# EasyEDA Pro project wireless charger receiver.eprj, board PCB2
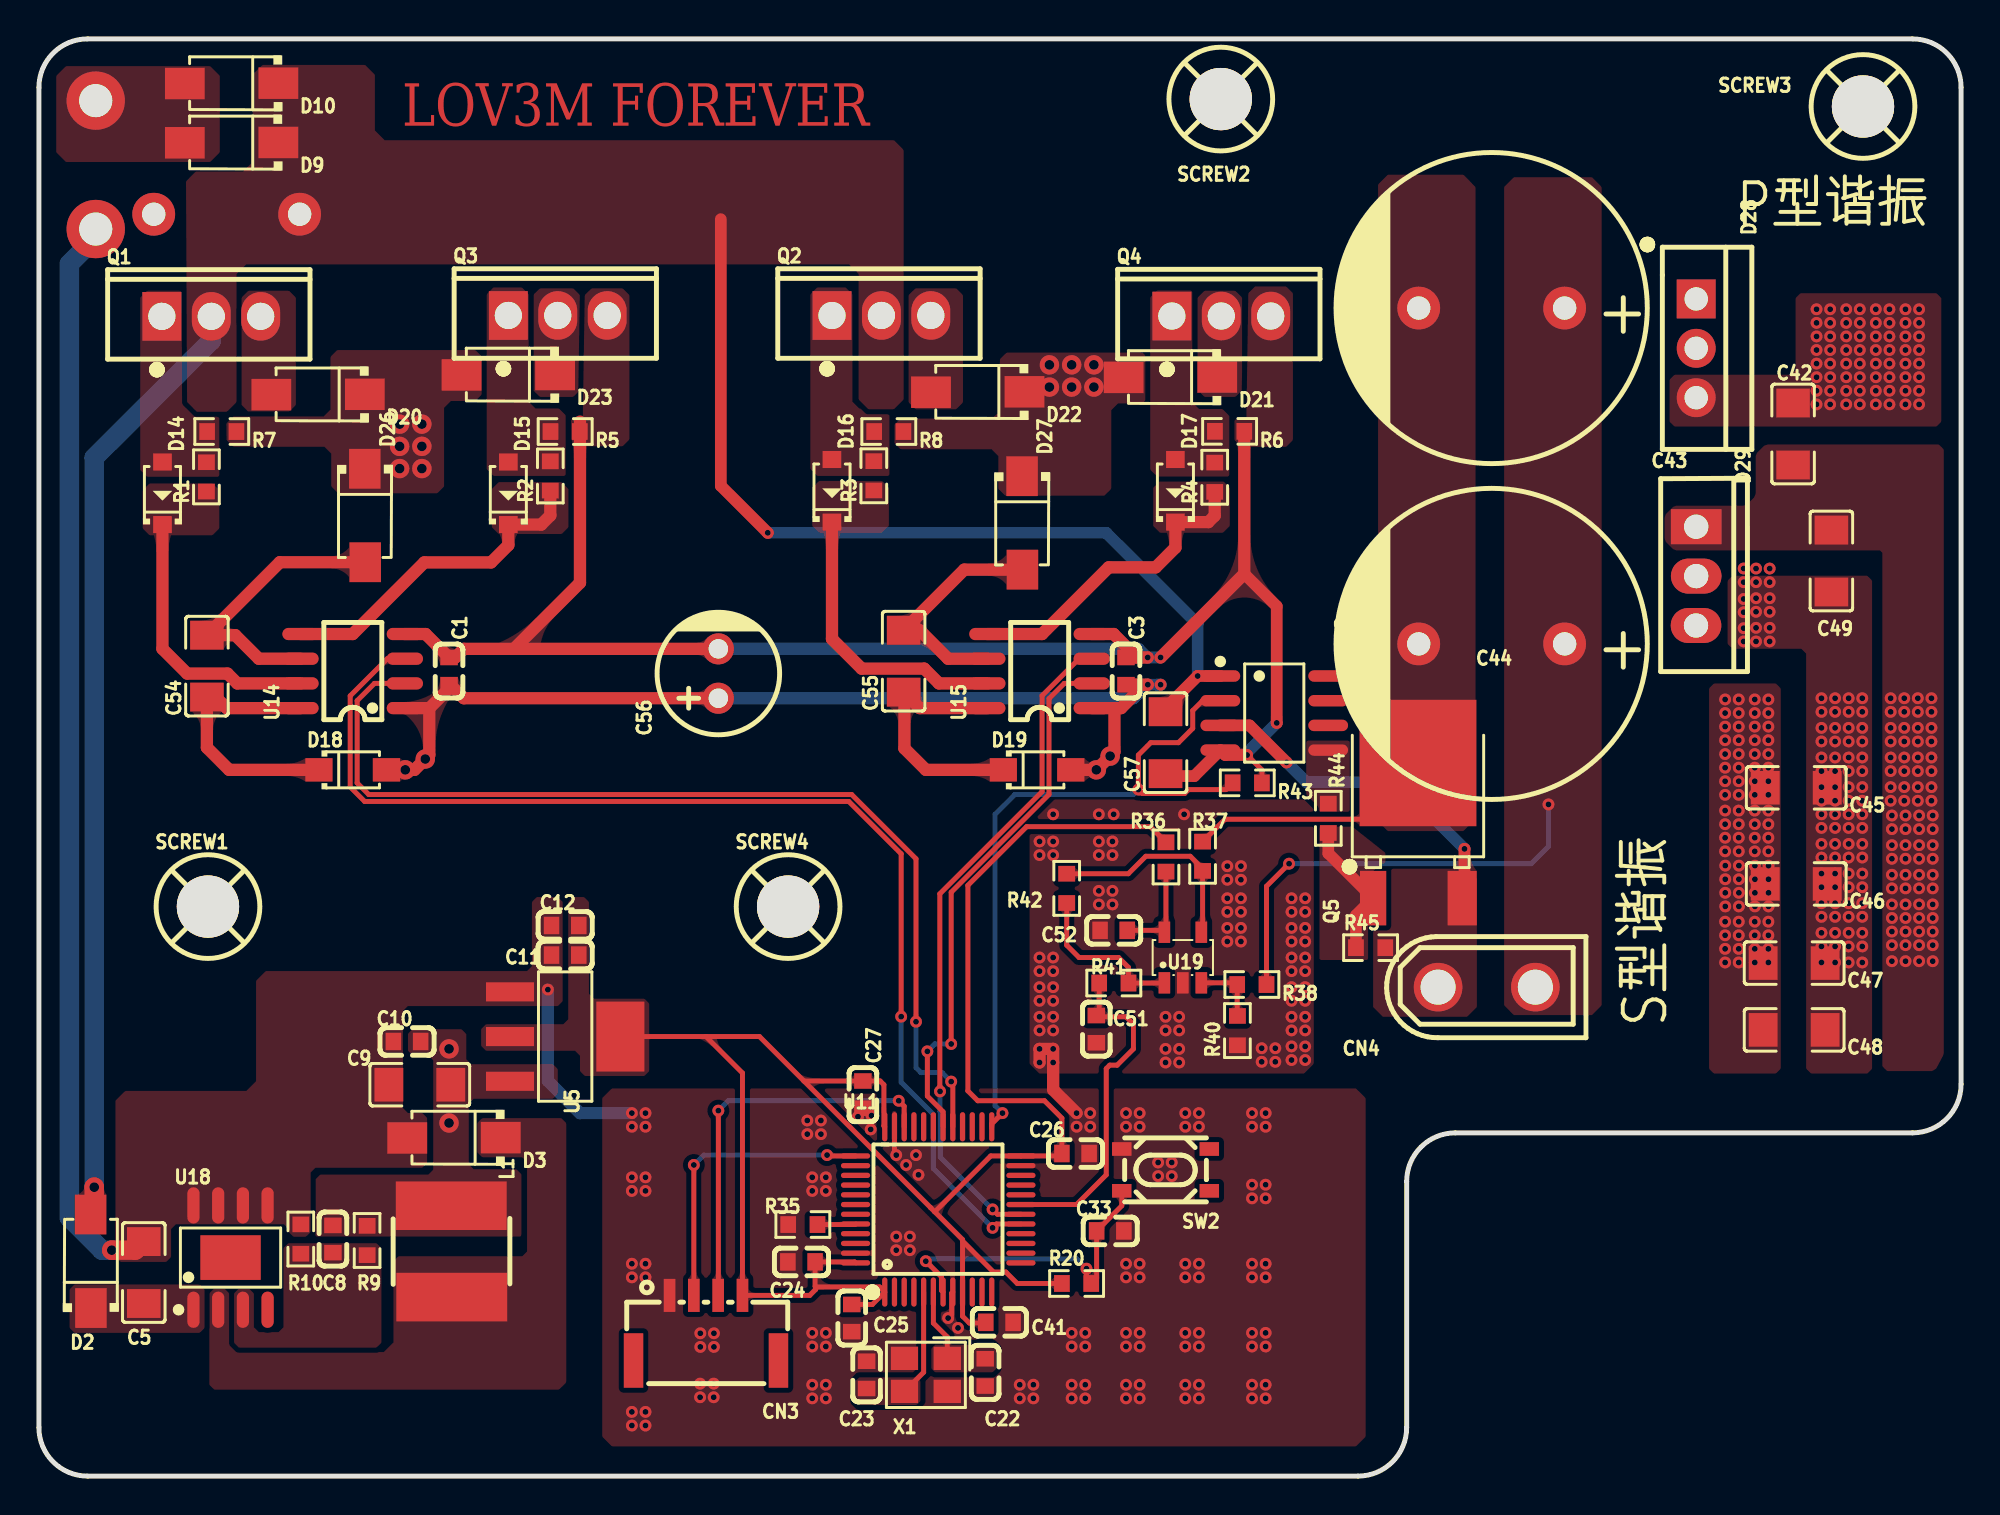
[diagram p3: board, top side]
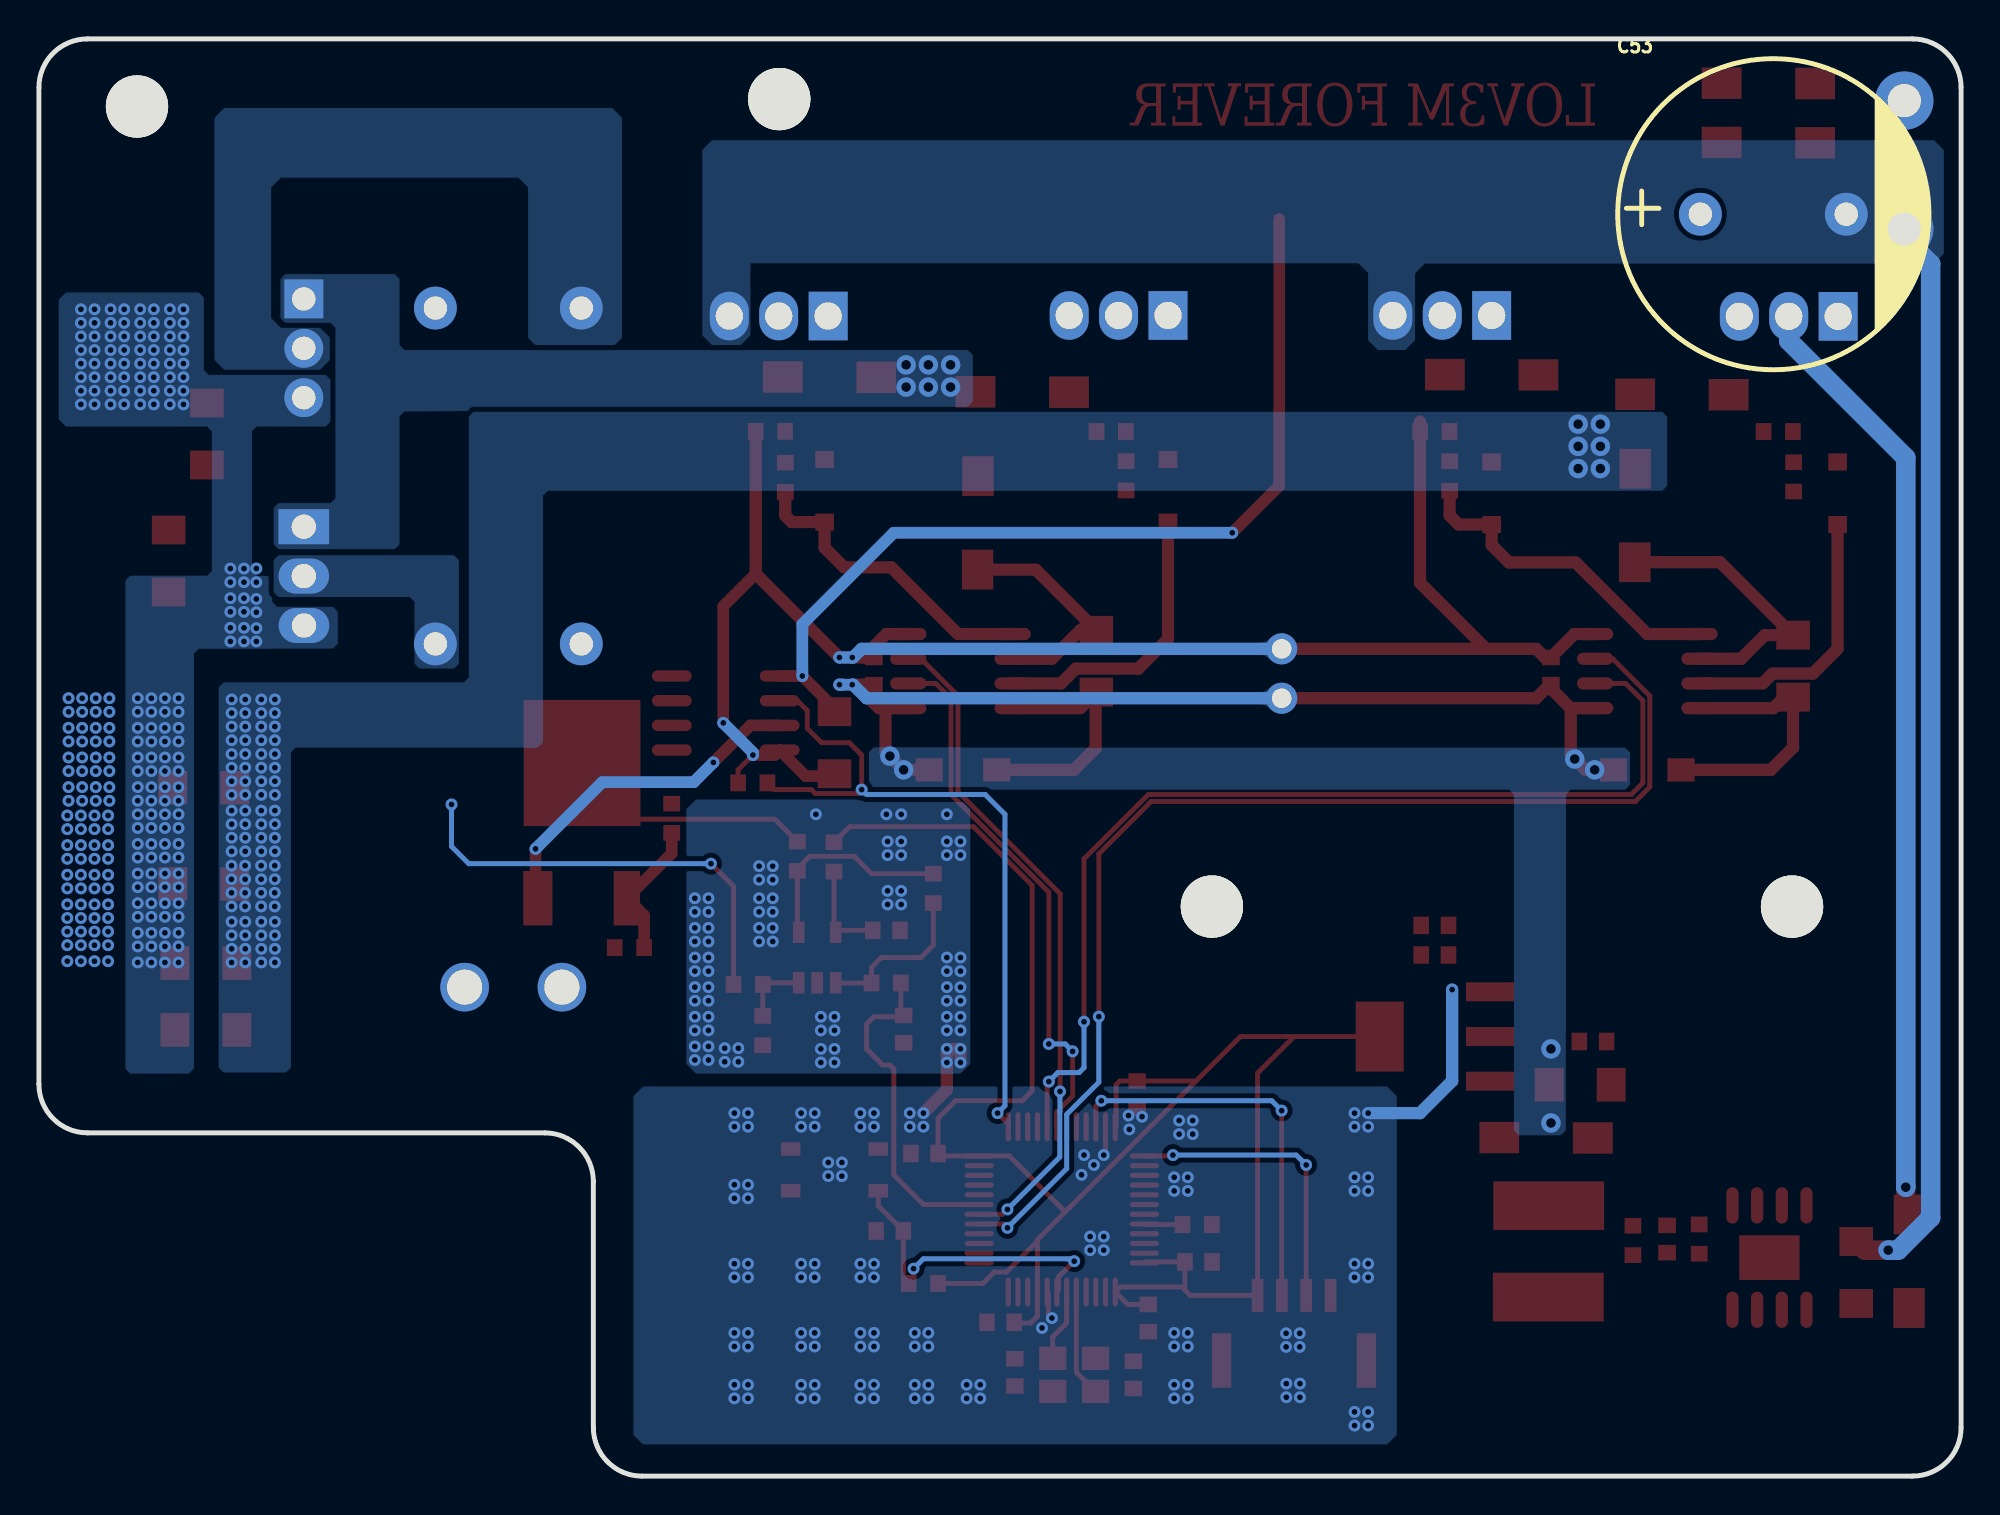
[diagram p4: board, bottom side, seen from below]

Outline 98.81 x 73.91 mm; copper layers: Top Layer, Bottom Layer. Coordinates in mm from the lower left corner of the outline.
Outline path: 0,71.41 0,2.5 arc(0.73,0.73) 2.5,0 67.81,0 arc(69.57,0.73) 70.31,2.5 70.31,15.15 arc(71.04,16.92) 72.81,17.65 96.31,17.65 arc(98.07,18.39) 98.81,20.15 98.81,71.41 arc(98.07,73.18) 96.31,73.91 2.5,73.91 arc(0.73,73.18) 0,71.41
Stack: Top Layer 0.035mm / Dielectric1 1.51mm FR4 er 4.5 / Bottom Layer 0.035mm

## Design rules (mm)
template: 自定义配置
spacing copperThickness1oz (default): track to track 0.102, other pairs 0.152 to 0.3
spacing copperThickness2oz: track to track 0.203, other pairs 0.152 to 0.3
track width copperThickness1oz (default): min 0.127, default 0.254, max 2.54
track width copperThickness2oz: min 0.203, default 0.254, max 2.54
differential pair differentialPair (default): width min 0.127, default 0.254, max 2.54; gap min 0.152, default 0.152
via viaSize (default): diameter min 0.5, default 0.61, max 10; hole min 0.3, default 0.305, max 6.3

## Placement (name value [footprint] x y rotation side)
C1  100nF  [C0603]  21.08 41.4 270 top
C3  100nF  [C0603]  55.88 41.4 270 top
C5  10uF  [C1206]  5.39 10.47 90 top
C8  33nF  [C0603]  15.11 12.19 90 top
C9  47uF  [C1206]  19.58 20.13 0 top
C10  100nF  [C0603]  18.92 22.35 0 top
C11  10uF  [C0603]  27.05 28.32 180 top
C12  100nF  [C0603]  27.05 26.8 0 top
C22  22pF  [C0603]  48.64 5.33 270 top
C23  22pF  [C0603]  42.55 5.21 270 top
C24  100nF  [C0603]  39.2 11.02 180 top
C25  100nF  [C0603]  41.78 8.13 270 top
C26  100nF  [C0603]  53.28 16.59 0 top
C27  100nF  [C0603]  42.36 19.62 270 top
C33  100nF  [C0603]  55.07 12.61 180 top
C41  100nF  [C0603]  49.37 7.91 180 top
C42  100nF  [C1206]  90.17 53.59 90 top
C43  470uF  [CAP-TH_BD16.0-P7.50-D1.2-FD]  74.68 60.07 180 top
C44  470uF  [CAP-TH_BD16.0-P7.50-D1.2-FD]  74.68 42.8 180 top
C45  ？nF  [C1206]  90.33 35.4 180 top
C46  ？nF  [C1206]  90.33 30.45 180 top
C47  ？nF  [C1206]  90.22 26.38 180 top
C48  ？nF  [C1206]  90.22 22.95 180 top
C49  ？nF  [C1206]  92.14 47.06 90 top
C51  10nF  [C0603]  54.36 22.99 270 top
C52  10nF  [C0603]  55.25 28.07 0 top
C53  470uF  [CAP-TH_BD16.0-P7.50-D1.2-FD]  9.65 64.9 180 bottom
C54  1uF  [C1206]  8.64 41.66 90 top
C55  1uF  [C1206]  44.45 41.91 90 top
C56  100uF  [CAP-TH_BD6.3-P2.50-D1.0-FD]  34.93 41.28 90 top
C57  10uF  [C1206]  57.91 37.72 90 top
CN3  ZX-BX-GH1.25-LT4  [CONN-SMD_ZX-BX-GH1.25-LT4]  34.29 7.62 0 top
CN4  XT30UPB-M  [CONN-TH_XT30UPB-M]  74.42 25.15 0 top
D2  SS510  [SMA_L4.3-W2.6-LS5.0-RD]  2.67 11.05 90 top
D3  SS510  [SMA_L4.3-W2.6-LS5.0-RD]  21.34 17.4 180 top
D9  SS520  [SMA_L4.3-W2.6-LS5.0-RD]  9.91 68.58 180 top
D10  SS520  [SMA_L4.3-W2.6-LS5.0-RD]  9.91 71.63 180 top
D14  1N4148W  [SOD-123_L2.7-W1.6-LS3.7-FD]  6.35 50.55 270 top
D15  1N4148W  [SOD-123_L2.7-W1.6-LS3.7-FD]  24.13 50.55 270 top
D16  1N4148W  [SOD-123_L2.7-W1.6-LS3.7-FD]  40.77 50.67 270 top
D17  1N4148W  [SOD-123_L2.7-W1.6-LS3.7-FD]  58.42 50.67 270 top
D18  FR107W  [SOD-123FL_L2.7-W1.8-LS3.8-RD]  16.13 36.32 0 top
D19  FR107W  [SOD-123FL_L2.7-W1.8-LS3.8-RD]  51.31 36.32 0 top
D20  SS520  [SMA_L4.3-W2.6-LS5.0-RD]  14.35 55.63 180 top
D21  SS520  [SMA_L4.3-W2.6-LS5.0-RD]  58.17 56.52 180 top
D22  SS520  [SMA_L4.3-W2.6-LS5.0-RD]  48.26 55.75 180 top
D23  SS520  [SMA_L4.3-W2.6-LS5.0-RD]  24.13 56.64 180 top
D26  SS520  [SMA_L4.3-W2.6-LS5.0-RD]  16.76 49.4 270 top
D27  SS520  [SMA_L4.3-W2.6-LS5.0-RD]  50.55 49.02 270 top
D28  MURF2060CTR  [TO-220F-3_L10.2-W4.7-P2.54-L]  85.19 58 270 top
D29  MURF2060CT  [TO-220-3_L9.9-W4.5-P2.54-L-1]  85.19 46.29 270 top
L1  100uH  [IND-SMD_L6.0-W6.0_FNR60XXS]  21.21 11.56 270 top
NOREF  -  [Pad_e615]  2.92 64.14 0 top
NOREF#2  -  [Pad_e617]  2.92 70.74 0 top
Q1  STP110N10F7-VB  [TO-220AB-3_L10.4-W4.6-P2.54-L]  8.86 59.64 0 top
Q2  STP110N10F7-VB  [TO-220AB-3_L10.4-W4.6-P2.54-L]  43.31 59.69 0 top
Q3  STP110N10F7-VB  [TO-220AB-3_L10.4-W4.6-P2.54-L]  26.67 59.69 0 top
Q4  STP110N10F7-VB  [TO-220AB-3_L10.4-W4.6-P2.54-L]  60.78 59.66 0 top
Q5  NCEP0178AK  [TO-252-2_L6.5-W6.1-P4.58-LS10.0-TL]  70.87 33.2 90 top
R1  4.7Ω  [R0603]  8.61 51.39 90 top
R2  4.7Ω  [R0603]  26.29 51.44 90 top
R3  4.7Ω  [R0603]  42.92 51.44 90 top
R4  4.7Ω  [R0603]  60.44 51.37 90 top
R5  10kΩ  [R0603]  27.05 53.72 180 top
R6  10kΩ  [R0603]  61.21 53.73 180 top
R7  10kΩ  [R0603]  9.4 53.72 180 top
R8  10kΩ  [R0603]  43.69 53.72 180 top
R9  30kΩ  [R0603]  16.87 12.12 90 top
R10  3.4kΩ  [R0603]  13.46 12.19 270 top
R20  10kΩ  [R0603]  53.34 9.91 180 top
R35  10kΩ  [R0603]  39.27 12.94 180 top
R36  100Ω  [R0603]  57.93 31.84 90 top
R37  40kΩ  [R0603]  59.82 31.88 270 top
R38  40kΩ  [R0603]  62.35 25.28 180 top
R40  1kΩ  [R0603]  61.61 22.91 90 top
R41  1kΩ  [R0603]  55.25 25.36 0 top
R42  1kΩ  [R0603]  52.83 30.23 90 top
R43  10kΩ  [R0603]  62.11 35.65 180 top
R44  4.7Ω  [R0603]  66.28 33.83 270 top
R45  10kΩ  [R0603]  68.45 27.18 0 top
SCREW1  -  [M3螺丝]  8.69 29.29 0 top
SCREW2  -  [M3螺丝]  60.75 70.82 0 top
SCREW3  -  [M3螺丝]  93.76 70.44 0 top
SCREW4  -  [M3螺丝]  38.51 29.29 0 top
SW2  TS3425BA  [SW-SMD_4P-L4.2-W3.2-P2.15-LS4.6-1]  57.91 15.75 180 top
U5  SPX1117M3-L-3-3/TR  [SOT-223-4_L6.5-W3.5-P2.30-LS7.0-BR]  27.05 22.61 180 top
U11  STM32F103C8T6  [LQFP-48_L7.0-W7.0-P0.50-LS9.0-BL]  46.23 13.72 0 top
U12  MX5014S  [SOIC-8_L4.9-W3.9-P1.27-LS6.0-BL]  63.5 39.24 270 top
U14  EG3113  [SOP-8_L4.9-W3.9-P1.27-LS6.0-BL]  16.13 41.4 90 top
U15  EG3113  [SOP-8_L4.9-W3.9-P1.27-LS6.0-BL]  51.44 41.4 90 top
U18  XL7005A  [SOIC-8_L4.9-W3.9-P1.27-LS6.0-BL-EP3.1-1]  9.85 11.24 0 top
U19  AD8605ARTZ-REEL7  [SOT-23-5_L3.0-W1.7-P0.95-LS2.8-BR]  58.8 26.67 270 top
X1  8MHz  [CRYSTAL-SMD_4P-L3.2-W2.5-BL]  45.59 5.21 180 top

## Footprints (pads in the part's own frame, mm; a bottom-side part is the same pattern mirrored in y, then rotated)
C0603
  rect 0.8x0.9 smd: 1(-0.7,0) 2(0.7,0)
C1206
  rect 1.485x1.728 smd: 1(-1.593,0) 2(1.593,0)
CAP-TH_BD6.3-P2.50-D1.0-FD
  round 1.6 hole 1: 1(-1.27,0) 2(1.27,0)
CAP-TH_BD16.0-P7.50-D1.2-FD
  round 2.2 hole 1.2: 1(-3.75,0) 2(3.75,0)
CONN-SMD_ZX-BX-GH1.25-LT4
  rect 0.6x1.7 smd: 1(-1.875,1.675) 2(-0.625,1.675) 3(0.625,1.675) 4(1.875,1.675)
  rect 1x2.8 smd: 5(3.725,-1.675) 6(-3.725,-1.675)
CONN-TH_XT30UPB-M
  round 2.5 hole 1.8: 1(-2.5,0) 2(2.5,0)
CRYSTAL-SMD_4P-L3.2-W2.5-BL
  rect 1.4x1.2 smd: 1(-1.1,-0.85) 2(1.1,-0.85) 3(1.1,0.85) 4(-1.1,0.85)
IND-SMD_L6.0-W6.0_FNR60XXS
  rect 2.5x5.7 smd: 1(-2.35,-0.013) 2(2.35,0.013)
LQFP-48_L7.0-W7.0-P0.50-LS9.0-BL
  oval 0.27x1.5 smd: 1(-2.75,-4.25) 2(-2.25,-4.25) 3(-1.75,-4.25) 4(-1.25,-4.25) 5(-0.75,-4.25) 6(-0.25,-4.25) 7(0.25,-4.25) 8(0.75,-4.25) 9(1.25,-4.25) 10(1.75,-4.25) 11(2.25,-4.25) 12(2.75,-4.25) 25(2.75,4.25) 26(2.25,4.25) 27(1.75,4.25) 28(1.25,4.25) 29(0.75,4.25) 30(0.25,4.25) 31(-0.25,4.25) 32(-0.75,4.25) 33(-1.25,4.25) 34(-1.75,4.25) 35(-2.25,4.25) 36(-2.75,4.25)
  oval 1.5x0.27 smd: 13(4.25,-2.75) 14(4.25,-2.25) 15(4.25,-1.75) 16(4.25,-1.25) 17(4.25,-0.75) 18(4.25,-0.25) 19(4.25,0.25) 20(4.25,0.75) 21(4.25,1.25) 22(4.25,1.75) 23(4.25,2.25) 24(4.25,2.75) 37(-4.25,2.75) 38(-4.25,2.25) 39(-4.25,1.75) 40(-4.25,1.25) 41(-4.25,0.75) 42(-4.25,0.25) 43(-4.25,-0.25) 44(-4.25,-0.75) 45(-4.25,-1.25) 46(-4.25,-1.75) 47(-4.25,-2.25) 48(-4.25,-2.75)
M3螺丝
  round 3.2 hole 3.2: 1(0,0)
Pad_e615
  round 3 hole 1.7: 1(0,0)
Pad_e617
  round 3 hole 1.7: 1(0,0)
R0603
  rect 0.806x0.864 smd: 1(-0.753,0) 2(0.753,0)
SMA_L4.3-W2.6-LS5.0-RD
  rect 2.046x1.62 smd: 1(-2.404,-0.009) 2(2.404,0.009)
SOD-123_L2.7-W1.6-LS3.7-FD
  rect 0.88x0.96 smd: 1(-1.61,0) 2(1.61,0)
SOD-123FL_L2.7-W1.8-LS3.8-RD
  rect 1.4x1.2 smd: 1(-1.735,0) 2(1.735,0)
SOIC-8_L4.9-W3.9-P1.27-LS6.0-BL
  oval 0.588x2.045 smd: 1(-1.905,-2.772) 2(-0.635,-2.772) 3(0.635,-2.772) 4(1.905,-2.772) 5(1.905,2.772) 6(0.635,2.772) 7(-0.635,2.772) 8(-1.905,2.772)
SOIC-8_L4.9-W3.9-P1.27-LS6.0-BL-EP3.1-1
  oval 0.63x1.865 smd: 1(-1.905,-2.683) 2(-0.635,-2.683) 3(0.635,-2.683) 4(1.905,-2.683) 5(1.905,2.683) 6(0.635,2.683) 7(-0.635,2.683) 8(-1.905,2.683)
  rect 3.1x2.3 smd: 9(0,0)
SOP-8_L4.9-W3.9-P1.27-LS6.0-BL
  oval 0.63x1.865 smd: 1(-1.905,-2.683) 2(-0.635,-2.683) 3(0.635,-2.683) 4(1.905,-2.683) 5(1.905,2.683) 6(0.635,2.683) 7(-0.635,2.683) 8(-1.905,2.683)
SOT-23-5_L3.0-W1.7-P0.95-LS2.8-BR
  rect 1.1x0.6 smd: 1(1.3,-0.95) 2(1.3,0) 3(1.3,0.95) 4(-1.3,0.95) 5(-1.3,-0.95)
SOT-223-4_L6.5-W3.5-P2.30-LS7.0-BR
  rect 2.47x0.98 smd: 1(2.835,-2.3) 2(2.835,0) 3(2.835,2.3)
  rect 2.47x3.6 smd: 4(-2.835,0)
SW-SMD_4P-L4.2-W3.2-P2.15-LS4.6-1
  rect 1x0.7 smd: 1(-2.25,1.075) 2(2.25,1.075) 3(-2.25,-1.075) 4(2.25,-1.075)
TO-220-3_L9.9-W4.5-P2.54-L-1
  rect 1.8x2.6 hole 1.25: 1(-2.54,0.005)
  oval 1.8x2.6 hole 1.25: 2(0,0.005) 3(2.54,-0.005)
TO-220AB-3_L10.4-W4.6-P2.54-L
  rect 2x2.5 hole 1.4: 1(-2.54,0)
  oval 2x2.5 hole 1.4: 2(0,0) 3(2.54,0)
TO-220F-3_L10.2-W4.7-P2.54-L
  rect 2x2 hole 1.2: 1(-2.54,0)
  round 2 hole 1.2: 2(0,0) 3(2.54,0)
TO-252-2_L6.5-W6.1-P4.58-LS10.0-TL
  rect 2.8x1.35 smd: 1(-3.475,2.29)
  rect 2.8x1.5 smd: 3(-3.475,-2.29)
  rect 6.5x6 smd: 4(3.475,-0.017)

## Nets
As in the schematic, except:
GND: C1.1 C3.1 C5.2 C9.1 C10.1 C11.2 C12.1 C22.2 C23.1 C24.2 C25.2 C26.2 C27.2 C33.1 C41.1 C51.2 C52.1 C53.2 C56.2 C57.1 CN3.1 D3.2 NOREF.1 Q3.3 Q4.3 R5.1 R6.1 R10.1 R35.2 R40.1 R43.1 SW2.4 U5.1 U11.8 U11.23 U11.35 U11.47 U12.4 U14.4 U15.4 U18.5 U18.6 U18.7 U18.8 U19.2 X1.2 X1.4
VREF: D9.2 D10.2 NOREF#2.1

Pads without a net: CN3 5 6; SCREW1 1; SCREW2 1; SCREW3 1; SCREW4 1; SW2 1 3; U11 2 3 4 10 11 12 13 14 15 16 20 21 22 26 27 28 31 32 33 38 39 40 41 42 43 45 46; U12 6 7 8; U18 4 9

## Via types
v1: diameter 1, hole 0.5, Top Layer to Bottom Layer, 20 vias
v2: diameter 0.61, hole 0.305, Top Layer to Bottom Layer, 548 vias

## Routing (per net, layer and track width the routed paths; a pad name or vN(x,y) marks a point on that pad's centre or on a via; arc(x,y) is an arc through that point)
+3.3V: length 104.1
  Top Layer w0.254: 39.32,20.32 37.04,22.61 34.29,22.61 ; 39.32,20.32 C27.1 43.24,20.32 43.43,20.13 43.43,18.01 U11.36 ; 39.32,20.32 45.84,13.81 45.84,13.8 46.05,13.59 ; R20.2 50.29,9.91 49.7,10.5 49.07,10.5 47.48,12.09 ; 39.93,9.73 39.9,9.76 C24.1 41.93,11.02 U11.48 ; 39.93,9.73 39.93,9.6 39.62,9.3 CN3.4 36.16,20.73 34.29,22.61 ; 39.93,9.73 43.22,9.73 U11.1 42.84,8.83 C25.1 ; 47.48,12.09 U11.9 47.48,8.22 47.82,7.87 48.64,7.87 48.67,7.91 ; 47.48,12.09 47.48,12.16 46.05,13.59 ; 46.05,13.59 48.93,16.47 U11.24 52.46,16.47 C26.1 52.58,18.41 51.69,19.3 48.26,19.3 47.75,19.81 47.75,30.38 50.77,33.4 57.13,33.4 R36.2 ; 34.29,22.61 U5.4
+12V: length 53.5
  Top Layer w0.63: v2(57,40.7) 56.39,40.7 56.39,40.26 55.63,39.5 55.29,39.5 ; 20.07,39.5 20.07,39.49 20.07,37.08 19.3,36.32 D18.2 ; 20.07,39.5 U14.1 ; 20.07,39.5 21.08,40.51 C1.2 21.15,40.7 21.84,40.01 C56.1 ; D19.2 v1(54.36,36.32) 55.29,37.25 55.29,39.5 ; U15.1 55.29,39.5
  Bottom Layer w0.6: 57.51,40.7 v2(57,40.7)
  Bottom Layer w0.63: v2(57.66,40.7) 57.51,40.7 ; v2(57,40.7) 56.96,40.7 56.26,40.01 C56.1
  vias: v1(18.83,36.32) v1(19.86,36.88) v1(21.08,21.97) v1(21.08,18.16) v1(55.06,37.03)
GND: length 160.3
  Top Layer w0.254: v2(46.74,8.13) 46.92,8.31 46.92,9.4 U11.8 ; v2(62.1,37.08) 62.87,36.32 R43.1 ; v2(44.07,16.51) 43.98,16.6 U11.35
  Top Layer w0.6: v2(63.63,38.73) 63.63,44.73 61.96,46.4 ; v2(62.1,37.08) 60.98,37.08 U12.4 59.39,36 58.42,36
  Top Layer w0.63: 27.81,54.23 27.81,45.94 24.41,42.55 ; U14.4 19.88,43.31 C1.1 21.4,42.1 21.84,42.55 24.41,42.55 ; U15.4 55.25,43.31 56.39,42.16 56.39,42.1 v2(57,42.1) ; v2(53.34,18.67) 52.14,19.87 v2(52.14,21.27) v2(52.14,21.97) v2(51.44,21.97) v2(51.44,21.27) ; 24.41,42.55 C56.2 ; R6.1 61.96,46.4 v2(57.66,42.1)
  Top Layer w1: v1(3.75,11.62) 4.95,11.62 C5.2
  Bottom Layer w0.6: v2(63.63,38.73) 62.1,37.21 v2(62.1,37.08)
  Bottom Layer w0.63: v2(26.16,25.02) 26.16,20.32 27.81,18.67 v2(30.48,18.67) ; C56.2 56.52,42.55 56.96,42.1 v2(57,42.1) v2(57.66,42.1)
  Bottom Layer w1: NOREF.1 2.92,63.7 1.57,62.34 1.57,13.29 3.24,11.62 v1(3.75,11.62)
  vias: v2(30.48,17.97) v2(30.48,15.37) v2(30.48,14.67) v2(30.48,10.92) v2(30.48,10.22) v2(30.48,3.3) v2(30.48,2.6) v2(31.18,18.67) v2(31.18,17.97) v2(31.18,15.37) v2(31.18,14.67) v2(31.18,10.92) v2(31.18,10.22) v2(31.18,3.3) v2(31.18,2.6) v2(34,7.34) v2(34,6.65) v2(33.99,4.76) v2(33.99,4.06) v2(34.7,7.34) v2(34.7,6.65) v2(34.69,4.76) v2(34.69,4.06) v2(39.5,18.29) v2(39.5,17.59) v2(39.75,15.37) v2(39.75,14.67) v2(39.75,7.37) v2(39.75,6.67) v2(39.75,4.7) v2(39.75,4) v2(40.2,18.29) v2(40.2,17.59) v2(40.45,15.37) v2(40.45,14.67) v2(40.45,7.37) v2(40.45,6.67) v2(40.45,4.7) v2(40.45,4) v2(42.1,18.48) v2(42.8,18.54) v2(42.76,17.83) v2(44.07,12.32) v2(44.07,11.62) v2(44.58,16) v2(44.77,12.32) v2(44.77,11.62) v2(45.09,16.51) v2(45.21,15.49) v2(47.24,7.62) v2(50.42,4.7) v2(50.42,4) v2(51.12,4.7) v2(51.12,4) v2(51.44,32.64) v2(51.44,31.94) v2(51.44,26.67) v2(51.44,25.97) v2(51.44,25.15) v2(51.44,24.45) v2(51.44,23.62) v2(51.44,22.92) v2(52.13,34.04) v2(52.14,32.64) v2(52.14,31.94) v2(52.14,26.67) v2(52.14,25.97) v2(52.14,25.15) v2(52.14,24.45) v2(52.14,23.62) v2(52.14,22.92) v2(53.09,7.37) v2(53.09,6.67) v2(53.09,4.7) v2(53.09,4) v2(53.34,17.97) v2(53.79,7.37) v2(53.79,6.67) v2(53.79,4.7) v2(53.79,4) v2(54.04,18.67) v2(54.04,17.97) v2(54.48,34.04) v2(54.48,32.64) v2(54.48,31.94) v2(54.48,30.1) v2(54.48,29.4) v2(55.18,32.64) v2(55.18,31.94) v2(55.18,30.1) v2(55.18,29.4) v2(55.25,34.04) v2(55.88,18.67) v2(55.88,17.97) v2(55.88,10.92) v2(55.88,10.22) v2(55.88,7.37) v2(55.88,6.67) v2(55.88,4.7) v2(55.88,4) v2(56.58,18.67) v2(56.58,17.97) v2(56.58,10.92) v2(56.58,10.22) v2(56.58,7.37) v2(56.58,6.67) v2(56.58,4.7) v2(56.58,4) v2(57.53,16.13) v2(57.53,15.43) v2(57.91,23.62) v2(57.91,22.92) v2(57.91,21.97) v2(57.91,21.27) v2(58.23,16.13) v2(58.23,15.43) v2(58.61,23.62) v2(58.61,22.92) v2(58.61,21.97) v2(58.61,21.27) v2(58.87,34.04) v2(58.93,18.67) v2(58.93,17.97) v2(58.93,10.92) v2(58.93,10.22) v2(58.93,7.37) v2(58.93,6.67) v2(58.93,4.7) v2(58.93,4) v2(59.63,18.67) v2(59.63,17.97) v2(59.63,10.92) v2(59.63,10.22) v2(59.63,7.37) v2(59.63,6.67) v2(59.63,4.7) v2(59.63,4) v2(61.09,31.37) v2(61.09,30.67) v2(61.09,29.72) v2(61.09,29.02) v2(61.09,28.19) v2(61.09,27.49) v2(61.79,31.37) v2(61.79,30.67) v2(61.79,29.72) v2(61.79,29.02) v2(61.79,28.19) v2(61.79,27.49) v2(62.36,18.67) v2(62.36,17.97) v2(62.36,14.99) v2(62.36,14.29) v2(62.36,10.92) v2(62.36,10.22) v2(62.36,7.37) v2(62.36,6.67) v2(62.36,4.7) v2(62.36,4) v2(62.85,22.01) v2(62.85,21.31) v2(63.06,18.67) v2(63.06,17.97) v2(63.06,14.99) v2(63.06,14.29) v2(63.06,10.92) v2(63.06,10.22) v2(63.06,7.37) v2(63.06,6.67) v2(63.06,4.7) v2(63.06,4) v2(63.55,22.01) v2(63.55,21.31) v2(64.39,29.72) v2(64.39,29.02) v2(64.39,28.19) v2(64.39,27.49) v2(64.39,26.67) v2(64.39,25.97) v2(64.39,25.15) v2(64.39,24.45) v2(64.39,23.62) v2(64.39,22.92) v2(64.39,22.1) v2(64.39,21.4) v2(65.09,29.72) v2(65.09,29.02) v2(65.09,28.19) v2(65.09,27.49) v2(65.09,26.67) v2(65.09,25.97) v2(65.09,25.15) v2(65.09,24.45) v2(65.09,23.62) v2(65.09,22.92) v2(65.09,22.1) v2(65.09,21.4)
VCC: length 96.3
  Top Layer w0.6: C57.2 57.91,39.5 v2(59.56,41.15) U12.1 ; v2(37.47,48.51) 35.05,50.93 35.05,64.64
  Top Layer w1: v1(2.84,14.86) 2.84,13.64 D2.2
  Bottom Layer w0.6: v2(37.47,48.51) 54.86,48.51 59.56,43.81 v2(59.56,41.15)
  Bottom Layer w1: v1(2.84,14.86) 2.84,52.37 8.86,58.39 Q1.2
A: length 15
  Top Layer w0.63: U14.6 11.3,42.04 10.09,43.25 C54.2 12.39,47 D26.2
B: length 12.3
  Top Layer w0.63: D27.2 47.57,46.62 C55.2 45.27,43.5 46.74,42.04 U15.6
BOOT0: length 2
  Top Layer w0.254: 40.02,12.94 41.95,12.94 U11.44
COIL+:
  vias: v1(18.54,54.1) v1(18.54,52.96) v1(18.54,51.82) v1(19.69,54.1) v1(19.69,52.96) v1(19.69,51.82) v2(86.68,39.94) v2(86.68,39.24) v2(86.68,38.55) v2(86.68,37.85) v2(86.68,37.13) v2(86.68,36.43) v2(86.68,35.74) v2(86.68,35.04) v2(86.68,34.23) v2(86.68,33.53) v2(86.68,32.83) v2(86.68,32.13) v2(86.68,31.4) v2(86.68,30.7) v2(86.68,30) v2(86.68,29.3) v2(86.68,28.51) v2(86.68,27.81) v2(86.68,27.12) v2(86.68,26.42) v2(87.38,39.94) v2(87.38,39.24) v2(87.38,38.55) v2(87.38,37.85) v2(87.38,37.13) v2(87.38,36.43) v2(87.38,35.74) v2(87.38,35.04) v2(87.38,34.23) v2(87.38,33.53) v2(87.38,32.83) v2(87.38,32.13) v2(87.38,31.4) v2(87.38,30.7) v2(87.38,30) v2(87.38,29.3) v2(87.38,28.51) v2(87.38,27.81) v2(87.38,27.12) v2(87.38,26.42) v2(88.2,39.94) v2(88.2,39.24) v2(88.2,38.55) v2(88.2,37.85) v2(88.2,37.13) v2(88.2,36.43) v2(88.2,35.74) v2(88.2,35.04) v2(88.2,34.23) v2(88.2,33.53) v2(88.2,32.83) v2(88.2,32.13) v2(88.21,31.4) v2(88.21,30.7) v2(88.21,30) v2(88.21,29.3) v2(88.2,28.51) v2(88.2,27.81) v2(88.2,27.12) v2(88.2,26.42) v2(88.9,39.94) v2(88.9,39.24) v2(88.9,38.55) v2(88.9,37.85) v2(88.9,37.13) v2(88.9,36.43) v2(88.9,35.74) v2(88.9,35.04) v2(88.9,34.23) v2(88.9,33.53) v2(88.9,32.83) v2(88.9,32.13) v2(88.91,31.4) v2(88.91,30.7) v2(88.91,30) v2(88.91,29.3) v2(88.9,28.51) v2(88.9,27.81) v2(88.9,27.12) v2(88.9,26.42)
COIL-:
  vias: v1(51.94,57.15) v1(51.94,56.01) v1(53.09,57.15) v1(53.09,56.01) v1(54.23,57.15) v1(54.23,56.01) v2(95.19,40.01) v2(95.19,39.31) v2(95.19,38.48) v2(95.19,37.78) v2(95.19,36.96) v2(95.19,36.26) v2(95.19,35.43) v2(95.19,34.73) v2(95.25,33.97) v2(95.25,33.27) v2(95.25,32.45) v2(95.25,31.75) v2(95.25,30.93) v2(95.25,30.23) v2(95.25,29.4) v2(95.25,28.7) v2(95.25,28.01) v2(95.25,27.31) v2(95.25,26.48) v2(95.89,40.01) v2(95.89,39.31) v2(95.89,38.48) v2(95.89,37.78) v2(95.89,36.96) v2(95.89,36.26) v2(95.89,35.43) v2(95.89,34.73) v2(95.95,33.97) v2(95.95,33.27) v2(95.95,32.45) v2(95.95,31.75) v2(95.95,30.93) v2(95.95,30.23) v2(95.95,29.4) v2(95.95,28.7) v2(95.95,28.01) v2(95.95,27.31) v2(95.95,26.48) v2(96.58,40.01) v2(96.58,39.31) v2(96.58,38.48) v2(96.58,37.78) v2(96.58,36.96) v2(96.58,36.26) v2(96.58,35.43) v2(96.58,34.73) v2(96.65,33.97) v2(96.65,33.27) v2(96.65,32.45) v2(96.65,31.75) v2(96.65,30.93) v2(96.65,30.23) v2(96.65,29.4) v2(96.65,28.7) v2(96.65,28.01) v2(96.65,27.31) v2(96.65,26.48) v2(97.28,40.01) v2(97.28,39.31) v2(97.28,38.48) v2(97.28,37.78) v2(97.28,36.96) v2(97.28,36.26) v2(97.28,35.43) v2(97.28,34.73) v2(97.35,33.97) v2(97.35,33.27) v2(97.35,32.45) v2(97.35,31.75) v2(97.35,30.93) v2(97.35,30.23) v2(97.35,29.4) v2(97.35,28.7) v2(97.35,28.01) v2(97.35,27.31) v2(97.35,26.48)
G: length 11.9
  Top Layer w0.254: 70.86,34.66 69.98,33.78 60.97,33.78 R37.1
HIN1: length 52.6
  Top Layer w0.254: v2(46.89,20.29) 46.98,20.2 U11.29 ; U14.2 17.25,40.77 16.36,39.88 16.36,35.65 16.95,35.05 41.78,35.05 45.09,31.75 v2(45.09,23.37)
  Bottom Layer w0.254: v2(45.09,23.37) 45.09,21.01 45.34,20.75 46.43,20.75 v2(46.89,20.29)
HIN2: length 28
  Top Layer w0.254: U11.30 46.48,18.74 45.67,19.55 v2(45.67,21.84) ; U15.2 52.71,40.77 51.92,39.98 51.92,35.05 46.89,30.03 v2(46.89,22.23)
  Bottom Layer w0.254: v2(46.89,22.23) 46.05,22.23 v2(45.67,21.84)
HO1: length 14.2
  Top Layer w0.63: U14.7 10.2,40.77 9.69,41.27 7.62,41.27 6.35,42.55 D14.2
HO2: length 14.9
  Top Layer w0.63: D16.2 40.77,43.05 42.29,41.53 45.51,41.53 46.27,40.77 U15.7
HS: length 17.9
  Top Layer w0.6: v2(73.28,32.26) 73.28,30.1 72.91,29.72 ; v2(64.14,36.7) 62.23,38.61 U12.3
  Bottom Layer w0.6: v2(73.28,32.26) 69.85,35.69 65.15,35.69 v2(64.14,36.7)
LIN1: length 60.8
  Top Layer w0.254: v2(49.02,12.77) 49.22,12.97 U11.17 ; U14.3 17.91,42.04 16,40.13 16,35.44 16.74,34.7 41.63,34.7 44.32,32 v2(44.32,23.63)
  Bottom Layer w0.254: v2(44.32,23.63) 44.32,20.25 45.97,18.6 45.97,15.81 v2(49.02,12.77)
LIN2: length 34.6
  Top Layer w0.254: v2(46.32,19.78) 46.32,20.04 46.31,20.05 46.31,29.95 51.56,35.2 51.56,40.14 53.47,42.04 U15.3 ; U11.18 49.27,13.47 v2(49.02,13.72)
  Bottom Layer w0.254: v2(46.32,19.78) 46.32,18.76 46.33,18.75 46.33,16.41 v2(49.02,13.72)
LO1: length 17.3
  Top Layer w0.63: U14.5 16.13,43.31 19.81,46.99 23.24,46.99 24.13,47.88 D15.2 25.82,48.94 26.29,49.4 R2.1
LO2: length 16.2
  Top Layer w0.63: U15.5 51.56,43.31 54.99,46.74 57.4,46.74 58.42,47.75 D17.2 60.11,49.06 60.44,49.39 60.44,50.62
OPENSIGNAL: length 37.2
  Top Layer w0.254: U12.2 59.82,39.88 59.31,39.37 59.31,38.45 58.57,37.72 57.15,37.72 56.52,37.08 v2(56.52,35.31) 56.72,35.11 58.89,35.11 59.09,35.31 61.01,35.31 R43.2 ; v2(49.53,18.67) 48.98,18.12 U11.25
  Bottom Layer w0.254: v2(49.53,18.67) 49.15,19.05 49.15,34.04 50.16,35.05 56.26,35.05 v2(56.52,35.31)
OSCIN: length 5.5
  Top Layer w0.254: X1.3 45.48,5.34 U11.5
OSCOUT: length 3.7
  Top Layer w0.254: X1.1 46.69,7.16 45.98,7.87 U11.6
RESET: length 16.8
  Top Layer w0.254: SW2.2 55.66,13.9 C33.2 54.37,10.18 R20.1 53.85,10.15 v2(53.85,10.67) ; U11.7 46.39,9.55 46.39,10.25 45.59,11.05 v2(45.59,11.05)
  Bottom Layer w0.254: v2(45.59,11.05) 45.71,11.18 53.34,11.18 v2(53.85,10.67)
SWCLK(PA14): length 15.2
  Top Layer w0.254: U11.37 40.56,16.47 v2(40.51,16.51) ; CN3.2 v2(33.66,16)
  Bottom Layer w0.254: v2(33.66,16) 34.17,16.51 v2(40.51,16.51)
SWDIO(PA13): length 20.4
  Top Layer w0.254: U11.34 44.48,19.02 v2(44.2,19.3) ; CN3.3 34.93,9.31 v2(34.93,18.8)
  Bottom Layer w0.254: v2(44.2,19.3) 35.43,19.3 v2(34.93,18.8)
V: length 22.6
  Top Layer w0.254: v2(64.26,31.5) 63.1,30.34 63.1,25.28
  Bottom Layer w0.254: v2(77.6,34.54) 77.6,32.39 76.71,31.5 v2(64.26,31.5)
V_DET: length 17.4
  Top Layer w0.254: U11.19 53.34,13.97 54.86,15.49 54.86,20.95 55.04,21.13 55.42,21.13 56.26,21.97 56.26,23.24 55.88,23.62 54.42,23.62 C51.1 54.5,23.83 R41.1
$1N4159: length 13.9
  Top Layer w0.63: D18.1 9.78,36.32 8.64,37.47 C54.1 9.09,40.06 9.65,39.5 U14.8
$1N4175: length 13
  Top Layer w0.63: U15.8 45.27,39.5 44.49,40.28 ; 44.49,40.28 C55.1 ; 44.49,40.28 44.49,37.43 45.59,36.32 D19.1
$1N4266:
  vias: v2(87.63,46.68) v2(87.63,45.97) v2(87.63,45.11) v2(87.63,44.43) v2(87.63,43.61) v2(87.63,42.93) v2(88.27,46.67) v2(88.27,45.97) v2(88.27,45.15) v2(88.27,44.45) v2(88.27,43.63) v2(88.27,42.93) v2(88.97,46.67) v2(88.97,45.97) v2(88.97,45.15) v2(88.97,44.45) v2(88.97,43.63) v2(88.97,42.93) v2(91.38,60.01) v2(91.38,59.31) v2(91.38,58.61) v2(91.38,57.91) v2(91.38,57.22) v2(91.38,56.52) v2(91.38,55.82) v2(91.38,55.12) v2(91.63,40.01) v2(91.63,39.31) v2(91.63,38.48) v2(91.63,37.78) v2(91.63,36.96) v2(91.63,36.26) v2(91.63,35.43) v2(91.63,34.73) v2(91.63,34.04) v2(91.63,33.34) v2(91.63,32.51) v2(91.63,31.81) v2(91.63,30.99) v2(91.63,30.29) v2(91.63,29.46) v2(91.63,28.76) v2(91.63,27.94) v2(91.63,27.24) v2(91.63,26.42) v2(92.08,60.01) v2(92.08,59.31) v2(92.08,58.61) v2(92.08,57.91) v2(92.08,57.22) v2(92.08,56.52) v2(92.08,55.82) v2(92.08,55.12) v2(92.33,40.01) v2(92.33,39.31) v2(92.33,38.48) v2(92.33,37.78) v2(92.33,36.96) v2(92.33,36.26) v2(92.33,35.43) v2(92.33,34.73) v2(92.33,34.04) v2(92.33,33.34) v2(92.33,32.51) v2(92.33,31.81) v2(92.33,30.99) v2(92.33,30.29) v2(92.33,29.46) v2(92.33,28.76) v2(92.33,27.94) v2(92.33,27.24) v2(92.33,26.42) v2(92.9,60.01) v2(92.9,59.31) v2(92.9,58.61) v2(92.9,57.91) v2(92.9,57.22) v2(92.9,56.52) v2(92.9,55.82) v2(92.9,55.12) v2(93.03,40.01) v2(93.03,39.31) v2(93.03,38.48) v2(93.03,37.78) v2(93.03,36.96) v2(93.03,36.26) v2(93.03,35.43) v2(93.03,34.73) v2(93.03,34.04) v2(93.03,33.34) v2(93.03,32.51) v2(93.03,31.81) v2(93.03,30.99) v2(93.03,30.29) v2(93.03,29.46) v2(93.03,28.76) v2(93.03,27.94) v2(93.03,27.24) v2(93.03,26.42) v2(93.6,60.01) v2(93.6,59.31) v2(93.6,58.61) v2(93.6,57.91) v2(93.6,57.22) v2(93.6,56.52) v2(93.6,55.82) v2(93.6,55.12) v2(93.73,40.01) v2(93.73,39.31) v2(93.73,38.48) v2(93.73,37.78) v2(93.73,36.96) v2(93.73,36.26) v2(93.73,35.43) v2(93.73,34.73) v2(93.73,34.04) v2(93.73,33.34) v2(93.73,32.51) v2(93.73,31.81) v2(93.73,30.99) v2(93.73,30.29) v2(93.73,29.46) v2(93.73,28.76) v2(93.73,27.94) v2(93.73,27.24) v2(93.73,26.42) v2(94.42,60.01) v2(94.42,59.31) v2(94.42,58.61) v2(94.42,57.91) v2(94.42,57.22) v2(94.42,56.52) v2(94.42,55.82) v2(94.42,55.12) v2(95.12,60.01) v2(95.12,59.31) v2(95.12,58.61) v2(95.12,57.91) v2(95.12,57.22) v2(95.12,56.52) v2(95.12,55.82) v2(95.12,55.12) v2(95.95,60.01) v2(95.95,59.31) v2(95.95,58.61) v2(95.95,57.91) v2(95.95,57.22) v2(95.95,56.52) v2(95.95,55.82) v2(95.95,55.12) v2(96.65,60.01) v2(96.65,59.31) v2(96.65,58.61) v2(96.65,57.91) v2(96.65,57.22) v2(96.65,56.52) v2(96.65,55.82) v2(96.65,55.12)
$1N4309: length 3.5
  Top Layer w0.254: 61.61,23.67 61.59,23.68 R38.2 61.51,25.37 U19.3
$1N4317: length 5.1
  Top Layer w0.254: C52.2 57.75,28.07 U19.5 57.93,28.05 R36.1
$1N4321: length 10.9
  Top Layer w0.254: R42.2 56,30.98 56.9,31.88 59.18,31.88 59.82,31.24 R37.2 59.82,28.04 U19.4
$1N4326: length 8.5
  Top Layer w0.254: R42.1 52.83,27.31 53.47,26.67 55.5,26.67 56.01,26.16 R41.2 57.84,25.36 U19.1
$1N17930: length 7.2
  Top Layer w0.6: R45.1 67.7,28.84 Q5.1 66.28,32.03 R44.2

## Copper pours and planes (outline as drawn; the poured copper is in the pictures)
+3.3V on Top Layer: 22.98,23.24 26.95,23.24 27.2,23.49 27.2,29.53 27.45,29.78 28.03,29.78 28.28,29.53 28.28,24.8 28.53,24.55 31.12,24.55 31.37,24.3 31.37,20.82 31.12,20.57 28.06,20.57 27.81,20.82 27.81,21.63 27.56,21.88 22.98,21.88 22.73,22.13 22.73,22.99
+12V on Top Layer: 14.21,12.31 24.8,12.31 24.8,15.53 24.55,15.78 22.35,15.78 22.1,16.03 22.1,19.16 22.35,19.41 26.42,19.41 26.67,19.66 26.67,20.93 26.42,21.18 22.22,21.18 21.97,21.43 21.97,22.74 21.72,22.99 19.2,22.99 18.95,22.74 18.95,21.89 19.2,21.64 20.01,21.64 20.26,21.39 20.26,15.75 20.01,15.5 14.46,15.5 14.21,15.25
+12V on Bottom Layer: 20.31,22.95 20.32,22.95 20.32,17.78 20.57,17.53 22.74,17.53 22.99,17.78 22.99,35.06 23.24,35.31 55.88,35.31 56.13,35.56 56.13,37.24 55.88,37.49 51.31,37.49 51.31,37.47 17.27,37.47 17.02,37.22 17.02,35.56 17.27,35.31 20.06,35.31 20.31,35.06
GND on Top Layer: 4.19,11.02 6.55,11.02 6.8,11.27 6.8,12.7 7.05,12.95 12.59,12.95 12.84,12.7 12.84,12.56 13.09,12.31 13.72,12.31 13.97,12.56 13.97,15.61 14.22,15.86 19.7,15.86 19.95,16.11 19.95,18.43 19.7,18.68 18.96,18.68 18.71,18.93 18.71,23.92 18.96,24.17 26.67,24.17 26.92,24.42 26.92,29.53 26.67,29.78 25.59,29.78 25.34,29.53 25.34,26.23 25.09,25.98 11.66,25.98 11.16,25.48 11.16,20.31 10.66,19.81 4.44,19.81 3.94,19.31 3.94,11.27
GND on Top Layer: 29.46,1.52 67.7,1.52 68.2,2.02 68.2,19.44 67.7,19.94 29.46,19.94 28.96,19.44 28.96,2.02
GND on Top Layer: 27.7,52.96 30,52.96 30.35,53.31 30.35,60.74 30,61.09 28.41,61.09 28.06,60.74 27.96,54.38 27.35,54.38 27.35,53.31
GND on Top Layer: 51.43,20.7 65.03,20.7 65.53,21.2 65.53,34.3 65.03,34.8 51.43,34.8 50.93,34.3 50.93,21.2
GND on Top Layer: 61.81,52.93 64.11,52.93 64.46,53.28 64.46,60.84 64.11,61.19 62.52,61.19 62.17,60.84 62.06,54.35 61.46,54.35 61.46,53.28
GND on Bottom Layer: 51.43,20.7 65.03,20.7 65.53,21.2 65.53,34.3 65.03,34.8 51.43,34.8 50.93,34.3 50.93,21.2
GND on Bottom Layer: 29.51,1.62 67.75,1.62 68.25,2.12 68.25,19.54 67.75,20.04 29.51,20.04 29.01,19.54 29.01,2.12
GND on Bottom Layer: 1.39,62.36 27.57,62.36 28.07,61.86 28.07,58.41 28.57,57.91 29.98,57.91 30.48,58.41 30.48,61.87 30.98,62.37 62.22,62.37 62.23,62.36 62.23,58.67 62.73,58.17 64.2,58.17 64.7,58.67 64.7,68.21 64.2,68.71 1.39,68.71 0.89,68.21 0.89,62.86
VCC on Top Layer: 10.99,72.08 10.99,67.59 10.49,67.09 8.06,67.09 7.56,66.59 7.62,55.23 8.12,54.74 9.66,54.74 10.16,55.24 10.16,61.82 10.66,62.32 41.64,62.32 42.14,61.82 42.14,55.36 42.64,54.86 43.95,54.86 44.45,55.36 44.45,68.21 43.95,68.71 17.77,68.71 17.27,69.21 17.27,72.08 16.77,72.58 11.49,72.58
COIL+ on Top Layer: 10,52.94 14.67,52.94 15.02,52.59 15.02,50.9 15.37,50.55 20.48,50.55 20.83,50.9 20.83,54.94 21.18,55.29 22.43,55.29 22.78,55.64 22.78,57.56 22.43,57.91 15.34,57.91 14.99,57.56 14.99,54.85 14.64,54.5 9.98,54.5 9.63,54.14 9.65,53.28
COIL+ on Top Layer: 86.1,20.7 89.28,20.7 89.53,20.95 89.53,40.52 89.28,40.77 86.1,40.77 85.85,40.52 85.85,20.95
COIL+ on Bottom Layer: 89.57,21.01 89.57,40.57 89.32,40.82 76.96,40.82 76.71,41.07 76.71,54.49 76.46,54.74 15.36,54.74 15.11,54.49 15.11,50.92 15.36,50.67 72.65,50.67 72.9,50.42 72.9,37.72 73.15,37.47 85.6,37.47 85.85,37.22 85.85,21.01 86.1,20.76 89.32,20.76
COIL- on Top Layer: 94.76,47.49 94.76,21.08 95.01,20.83 97.31,20.83 97.53,20.96 97.89,21.64 97.92,21.75 97.92,52.81 97.67,53.06 88.85,53.06 88.67,52.98 88.32,52.63 88.24,52.45 88.24,50.51 88.17,50.34 87.82,49.98 87.64,49.91 84.17,49.91 83.99,49.84 83.64,49.48 83.57,49.31 83.57,48.21 83.64,48.03 83.99,47.68 84.17,47.61 94.64,47.61
COIL- on Top Layer: 44.29,52.81 48.96,52.81 49.31,52.46 49.31,50.77 49.66,50.42 54.77,50.42 55.12,50.77 55.12,54.82 55.47,55.17 56.72,55.17 57.07,55.52 57.07,57.44 56.72,57.78 49.75,57.78 49.4,57.44 49.35,54.73 49,54.39 44.29,54.39 43.94,54.04 43.94,53.16
COIL- on Bottom Layer: 80.01,57.91 51.05,57.91 50.8,57.66 50.8,55.25 51.05,55 80.02,54.75 80.26,54.5 80.26,47.92 80.51,47.67 86.49,47.67 86.74,47.92 86.74,49.79 86.49,50.04 83.82,50.04 83.57,50.29 83.57,59.06 83.82,59.31 86.14,59.31 86.39,59.56 86.39,61.57 86.14,61.82 80.51,61.82 80.26,61.57 80.26,58.16
G on Top Layer: 69.33,33.17 73.22,33.17 73.84,33.8 73.84,66.3 73.22,66.93 69.33,66.93 68.83,66.43 68.83,33.67
G on Bottom Layer: 69.33,58.04 73.16,58.04 73.66,58.54 73.66,66.27 74.16,66.77 86.37,66.77 86.87,66.27 86.87,59.56 86.37,59.06 84.35,59.06 83.85,58.56 83.85,57.4 84.35,56.9 89.28,56.9 89.78,57.4 89.78,69.86 89.28,70.36 69.33,70.36 68.83,69.86 68.83,58.54
GATE on Top Layer: 65.15,37.82 67.39,37.82 67.39,34.06 65.15,34.06
HO1 on Top Layer: 5.68,48.39 8.92,48.39 9.27,48.74 9.27,50.7 8.92,51.05 5.68,51.05 5.33,50.7 5.33,48.74
HO2 on Top Layer: 40.1,48.51 43.34,48.51 43.69,48.86 43.69,50.83 43.34,51.18 40.1,51.18 39.75,50.83 39.75,48.86
HS on Top Layer: 69.08,23.62 73.41,23.62 73.91,24.12 73.91,30.74 73.41,31.24 69.08,31.24 68.58,30.74 68.58,24.12
LO1 on Top Layer: 23.63,48.45 26.87,48.45 27.22,48.8 27.22,50.77 26.87,51.12 23.63,51.12 23.28,50.77 23.28,48.8
LO2 on Top Layer: 57.63,48.51 60.86,48.51 61.21,48.86 61.21,50.83 60.86,51.18 57.63,51.18 57.28,50.83 57.28,48.86
OSCIN on Top Layer: 42.16,3.66 45.12,3.66 45.31,3.85 45.31,4.88 45.12,5.08 42.16,5.08 41.97,4.88 41.97,3.85
OSCOUT on Top Layer: 49.02,6.76 46.07,6.76 45.87,6.56 45.87,5.53 46.07,5.33 49.02,5.33 49.22,5.53 49.22,6.56
V on Top Layer: 80.33,24.21 80.33,66.3 79.83,66.8 75.82,66.8 75.32,66.3 75.32,24.21 75.82,23.71 79.83,23.71
V on Bottom Layer: 79.5,41.78 79.5,44.96 79.75,45.21 86.49,45.21 86.74,45.46 86.74,47.11 86.49,47.36 77.47,47.36 77.22,47.11 77.22,41.78 77.47,41.53 79.25,41.53
VREF on Top Layer: 1.39,67.58 8.8,67.58 9.3,68.08 9.3,72.02 8.8,72.52 1.39,72.52 0.89,72.02 0.89,68.08
$1N4138 on Top Layer: 5.21,60.61 5.21,51.74 5.56,51.39 9.29,51.39 9.27,51.4 9.27,54.51 8.92,54.86 7.72,54.86 7.37,55.21 7.37,60.92 7.32,60.96 5.56,60.96
$1N4143 on Top Layer: 23.02,60.78 23.02,51.78 23.37,51.44 27.1,51.44 27.08,51.45 27.08,54.56 26.73,54.91 25.53,54.91 25.18,55.26 25.18,60.78 24.83,61.13 23.37,61.13
$1N4144 on Top Layer: 39.65,60.78 39.65,51.78 40,51.44 43.73,51.44 43.72,51.45 43.72,54.56 43.37,54.91 42.16,54.91 41.81,55.26 41.81,60.78 41.46,61.13 40,61.13
$1N4149 on Top Layer: 57.12,60.63 57.12,51.76 57.47,51.41 61.2,51.41 61.19,51.42 61.19,54.53 60.84,54.88 59.63,54.88 59.28,55.23 59.28,60.93 59.24,60.98 57.47,60.98
$1N4184 on Top Layer: 10.76,54.74 12.86,54.74 13.21,55.09 13.21,60.61 12.86,60.96 10.76,60.96 10.41,60.61 10.41,55.09
$1N4185 on Top Layer: 59.91,55.5 61.5,55.5 61.85,55.85 61.85,60.61 61.5,60.96 59.91,60.96 59.56,60.61 59.56,55.85
$1N4186 on Top Layer: 45.05,54.86 47.15,54.86 47.5,55.21 47.5,60.74 47.15,61.09 45.05,61.09 44.7,60.74 44.7,55.21
$1N4191 on Top Layer: 10.28,9.65 10.8,9.65 11.05,9.4 11.05,7.65 11.3,7.4 12.32,7.4 12.57,7.65 12.57,11.73 12.82,11.98 17.35,11.98 17.6,11.73 17.6,6.85 17.35,6.6 10.28,6.6 10.03,6.85 10.03,9.4
$1N4266 on Top Layer: 84.07,53.98 97.54,53.98 97.79,54.23 97.79,60.58 97.54,60.83 90.55,60.83 90.3,60.58 90.3,56.89 90.05,56.64 84.07,56.64 83.82,56.39 83.82,54.23
$1N4266 on Top Layer: 91.09,20.7 93.98,20.7 94.23,20.95 94.23,46.05 93.98,46.3 87.06,46.3 86.81,46.05 86.81,42.8 87.06,42.55 90.59,42.55 90.84,42.3 90.84,20.95
$1N4266 on Bottom Layer: 90.33,56.89 90.33,60.62 90.58,60.87 97.41,60.87 97.79,60.5 97.79,54.35 97.41,53.98 90.17,53.98 89.92,53.73 89.92,46.55 90.17,46.3 94.11,46.3 94.36,46.05 94.36,20.95 94.11,20.7 91.09,20.7 90.84,20.95 90.84,42.3 90.59,42.55 86.81,42.55 86.81,42.56 83.69,42.56 83.44,42.81 83.44,44.45 83.69,44.7 86.56,44.7 86.81,44.95 86.81,46.05 87.06,46.3 87.61,46.3 87.86,46.55 87.86,53.73 87.61,53.98 84.07,53.98 83.82,54.23 83.82,56.39 84.07,56.64 90.08,56.64
$1N4341 on Top Layer: 1.83,7.37 8.26,7.37 8.51,7.62 8.51,9.6 8.26,9.85 1.83,9.85 1.58,9.6 1.58,7.62
$1N4344 on Top Layer: 9.01,9.66 9.53,9.66 9.78,9.41 9.78,6.88 10.28,6.38 17.73,6.38 18.23,6.88 18.23,11.05 18.48,11.3 24.84,11.3 25.09,11.55 25.09,16.15 24.84,16.4 22.79,16.4 22.54,16.65 22.54,18.16 22.79,18.41 26.85,18.41 27.1,18.16 27.1,4.82 26.73,4.44 9.01,4.44 8.76,4.69 8.76,9.41
$1N4547 on Top Layer: 25.75,55.5 27.46,55.5 27.81,55.85 27.81,60.74 27.46,61.09 25.75,61.09 25.4,60.74 25.4,55.85
$1N17930 on Top Layer: 65.82,26.54 68.33,26.54 68.33,28.34 69.22,28.34 69.22,32.05 67.31,33.56 65.82,33.56

Small or netless copper shapes (teardrops, artwork), in the pictures only: 144 on Top Layer, 29 on Bottom Layer

## Text on the board
Top Layer: LOV3M FOREVER
Top Solder Mask Layer: CMeSummer
Top Silkscreen Layer: S型谐振 | P型谐振
